# EAGLE design CPUI_Board (EAGLE 7.7.0)
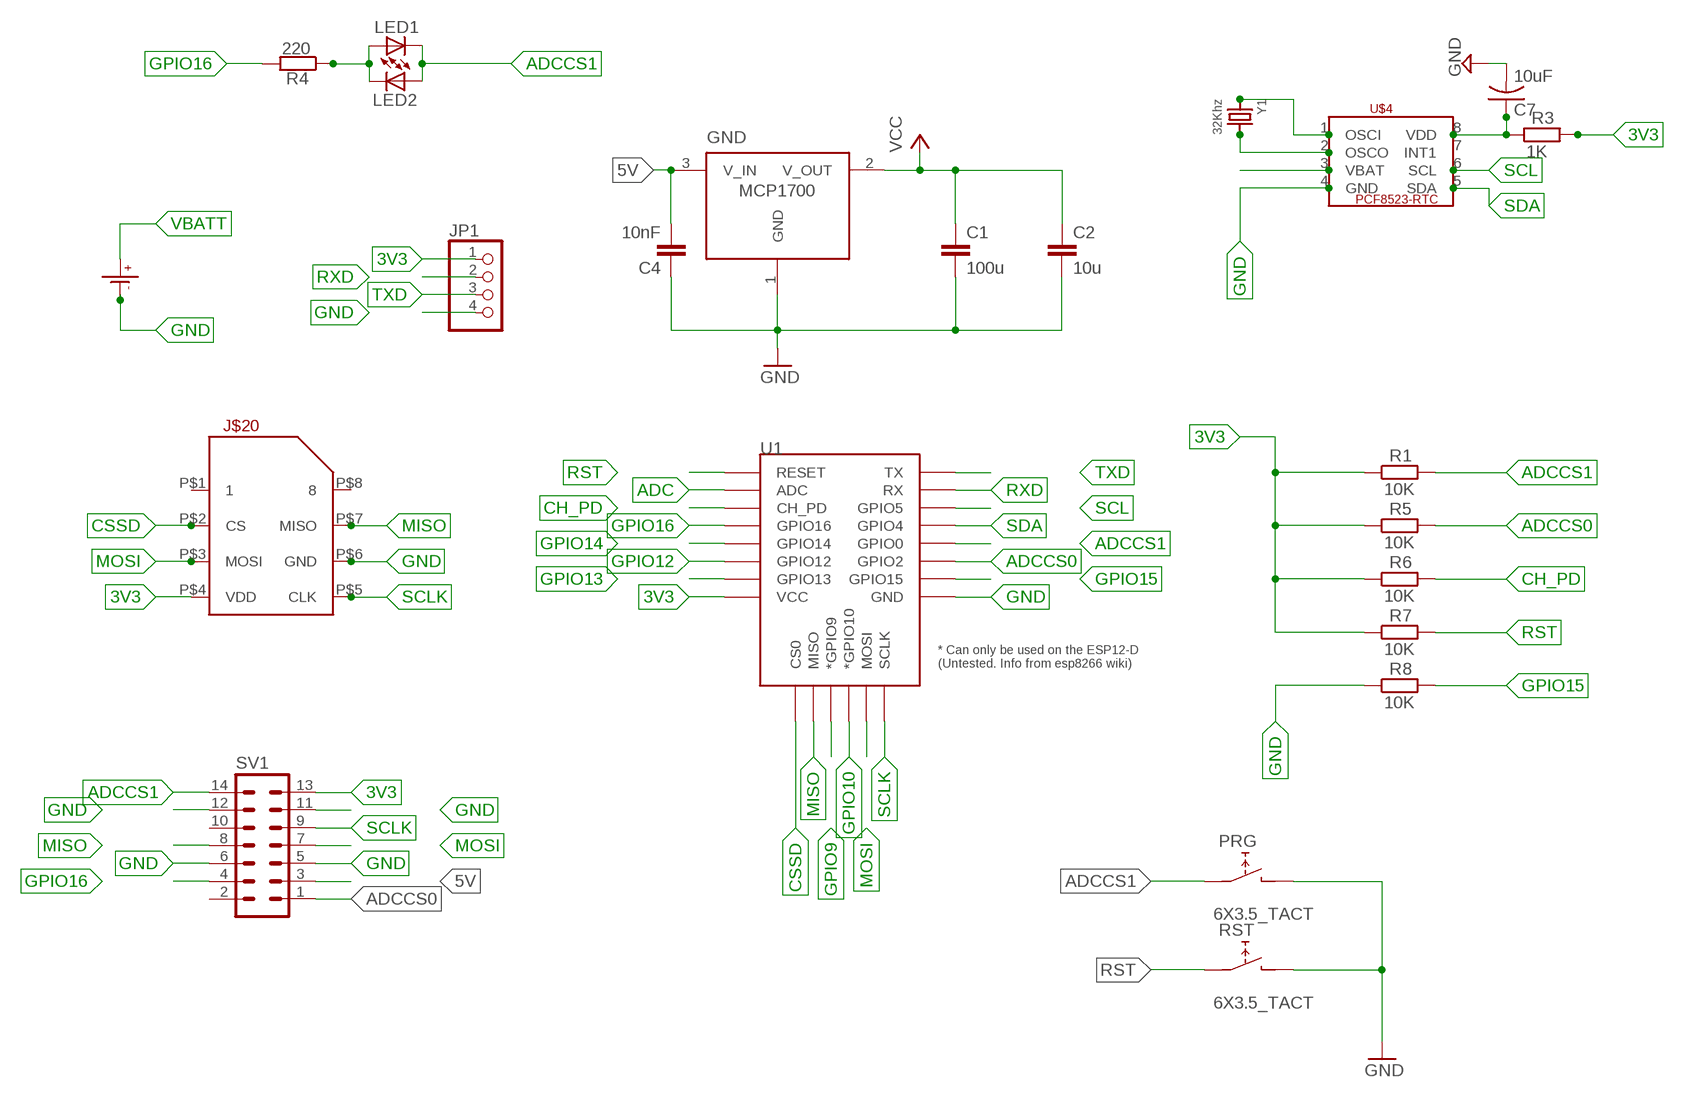
[diagram p0: schematic, sheet 1]

## Parts
C1  100u  C  [C0805]
C2  10u  C  [C0805]
C4  10nF  C  [C0805]
C7  10uF  C-USC0805  [C0805]
GND  MCP1700SOT23  [SOT-23]
J$20  MICROSD_PUSH/PULL  [MICROSD]
JP1  PINHD-1X4  [1X04]
LED1  LEDCHIPLED_0805  [CHIPLED_0805]
LED2  LEDCHIPLED_0805  [CHIPLED_0805]
PRG  6X3.5_TACT  [TACT_6X3.5]
R1  10K  R-EU_R0805  [R0805]
R3  1K  R-EU_R0805  [R0805]
R4  220  R-EU_R0805  [R0805]
R5  10K  R-EU_R0805  [R0805]
R6  10K  R-EU_R0805  [R0805]
R7  10K  R-EU_R0805  [R0805]
R8  10K  R-EU_R0805  [R0805]
RST  6X3.5_TACT  [TACT_6X3.5]
SV1  MA07-2  [MA07-2]
U1  ESP12ESMD  [ESP12E-SMD]
U$1  CR1220SMD  [CR1220SMD]
U$4  PCF8523_RTC  [SOIC_8]
Y1  32Khz  CRYSTAL8X3.8SMT  [CRYSTAL_8X3.8]

## Nets
3V3: C1.1 C2.1 GND.2(V_OUT) J$20.P$4(VDD) JP1.1 R1.1 R3.2 R5.1 R6.1 R7.1 SV1.13 U1.VCC ; supply symbol labelled VCC
5V: C4.2 GND.3(V_IN) SV1.3
ADC: U1.ADC
ADCCS0: R5.2 SV1.1 U1.GPIO2
ADCCS1: LED1.C LED2.A PRG.P$1 R1.2 SV1.14 U1.GPIO0
CH_PD: R6.2 U1.CH_PD
CSSD: J$20.P$2(CS) U1.CS0
GND: C1.2 C2.2 C4.1 C7.2 GND.1(GND) J$20.P$6(GND) JP1.4 PRG.P$2 R8.1 RST.P$2 SV1.5 SV1.6 SV1.11 SV1.12 U1.GND U$1.P-(P$-) U$4.4(GND)
GPIO9: U1.GPIO9(*GPIO9)
GPIO10: U1.GPIO10(*GPIO10)
GPIO12: U1.GPIO12
GPIO13: U1.GPIO13
GPIO14: U1.GPIO14
GPIO15: R8.2 U1.GPIO15
GPIO16: R4.2 SV1.4 U1.GPIO16
MISO: J$20.P$7(MISO) SV1.8 U1.MISO
MOSI: J$20.P$3(MOSI) SV1.7 U1.MOSI
N$1: C7.1 R3.1 U$4.8(VDD)
N$8: LED1.A LED2.C R4.1
N$44: U$4.2(OSCO) Y1.P$4
N$45: U$4.1(OSCI) Y1.P$1
RST: R7.2 RST.P$1 U1.RESET
RXD: JP1.2 U1.RXD0(RX)
SCL: U1.GPIO5 U$4.6(SCL)
SCLK: J$20.P$5(CLK) SV1.9 U1.SCLK
SDA: U1.GPIO4 U$4.5(SDA)
TXD: JP1.3 U1.TXD0(TX)
VBATT: U$1.P+(P$+) U$4.3(VBAT)
Unconnected: J$20.P$1 J$20.P$8 SV1.2 SV1.10 U$4.7(INT1)

## Library data of the parts
C1 C2 C4 = eagle-ltspice:C: CAPACITOR, European symbol; SPICEMODEL: NONE; SPICEPREFIX: C
C7 = adafruit:C-US: CAPACITOR, American symbol
GND = MCP1700:MCP1700SOT23
J$20 = IotaWatt_parts:MICROSD_PUSH/PULL: McroSD Amphenol push/pull
JP1 = pinhead:PINHD-1X4: PIN HEADER
LED1 LED2 = adafruit:LED: LED OSRAM: - CHIPLED LG R971, LG N971, LY N971, LG Q971, LY Q971, LO R971, LY R971 LH N974, LH R974 LS Q976, LO Q976, LY Q976 LO Q996 - Hyper CHIPLED LW Q18S LB Q993, LB Q99A, LB R99A - SideLED LS A670, LO A670, LY A670, LG A670, LP A670 LB A673, LV A673, LT A673, LW A673 LH A674 LY A675 LS A676, LA A676, LO A676, LY A676, LW A676 LS A679, LY A679, LG A679 - Hyper Micro SIDELED® LS Y876, LA Y876, LO Y876, LY Y876 LT Y87S - SmartLED LW L88C, LW L88S LB L89C, LB L89S, LG L890 LS L89K, LO L89K, LY L89K LS L896, LA L896, LO L896, LY L896 - TOPLED LS T670, LO T670, LY T670, LG T670, LP T670 LSG T670, LSP T670, LSY T670, LOP T670, LYG T670 LG T671, LOG T671, LSG T671 LB T673, LV T673, LT T673, LW T673 LH T674 LS T676, LA T676, LO T676, LY T676, LB T676, LH T676, LSB T676, LW T676 LB T67C, LV T67C, LT T67C, LS T67K, LO T67K, LY T67K, LW E67C LS E67B, LA E67B, LO E67B, LY E67B, LB E67C, LV E67C, LT E67C LW T67C LS T679, LY T679, LG T679 LS T770, LO T770, LY T770, LG T770, LP T770 LB T773, LV T773, LT T773, LW T773 LH T774 LS E675, LA E675, LY E675, LS T675 LS T776, LA T776, LO T776, LY T776, LB T776 LHGB T686 LT T68C, LB T68C - Hyper Mini TOPLED® LB M676 - Mini TOPLED Santana® LG M470 LS M47K, LO M47K, LY M47K Source: http://www.osram.convergy.de/
PRG RST = tactile_switch:6X3.5_TACT
R1 R3-R8 = resistor:R-EU_: RESISTOR, European symbol
SV1 = con-lstb:MA07-2: PIN HEADER; OC_FARNELL: unknown; OC_NEWARK: unknown
U1 = esp8266modules:ESP12E: ESP12E Module
U$1 = IotaWatt4.8:CR1220SMD: CR1220 Battery SMD
U$4 = IotaWatt_parts:PCF8523_RTC: PCF8523-RTC SOIC-8
Y1 = microbuilder:CRYSTAL: Crystals HC49UP - Surface Mount Crystal 4.0MHz 18pF +/-30ppm Surface Mount Crystal [Digikey: 535-9857-1-ND] 12.0 MHz Surface Mount Crystal [Digikey: 535-9869-6-ND] 25.0 MHz Surface Mount Crystal [Digikey: 535-9078-1-ND] 2.5 x 2.0mm - MEMs SMT Crystal 16.0 MHz 10pF 20ppm 2.5 x 2.0mm Crystal [Digikey -40-85°C: 535-10923-1-ND] 3.2 x 2.5mm - MEMs SMT Crystal 12.0 MHz 8pF 15ppm 3.2 x 2.5mm Crystal [Digikey: -10-70°C: 644-1047-1-ND -40-125°C: 644-1128-1-ND] 16.0 MHz 8pF 15ppm 3.2 x 2.5mm Crystal [Digikey: -10-70°C: 644-1049-1-ND -40-125°C: 644-1129-2-ND] 16.0 MHz 10pF 10ppm 3.2 x 2.5mm Crystal [Digikey: 644-1100-1-ND] 27.12 MHz 18pF 30ppm 3.2 x 2.5mm Crystal [Digikey: 887-1424-1-ND] 27.12MHz 10pF 10ppm 3.2 x 2.5mm Crystal [Digikey: 887-1329-1-ND] 4.9 x 1.8mm - MEMs SMT Crystal 32.768 KHz 12.5pF 20ppm 4.9 x 1.8mm Crystal [Digikey: SE2415CT-ND] 8.0 x 3.8mm - Surface Mount Crystal 32.768kHz 12.5pF 20ppm -40°C-85°C [Digikey: 535-9166-2-ND] Cylinder 32.768KHz Cylinder Crystal (2x6mm body) [Ex. Digikey: 300-8341-2-ND]

## Board
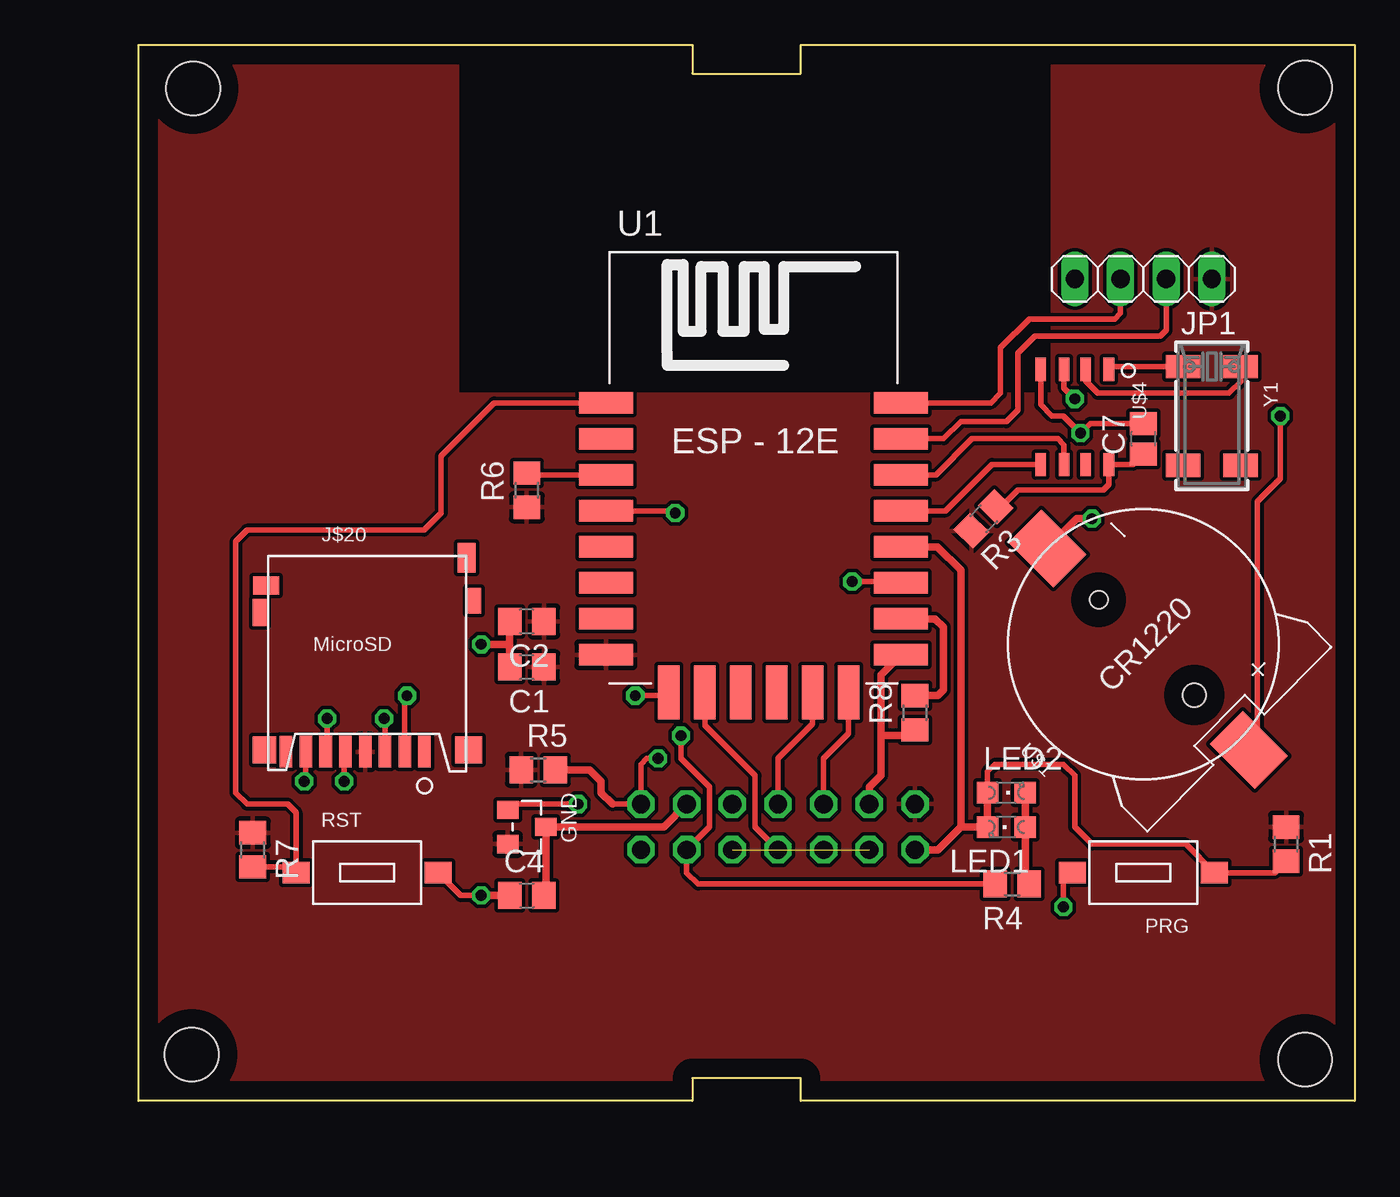
[diagram p1: board, top side]
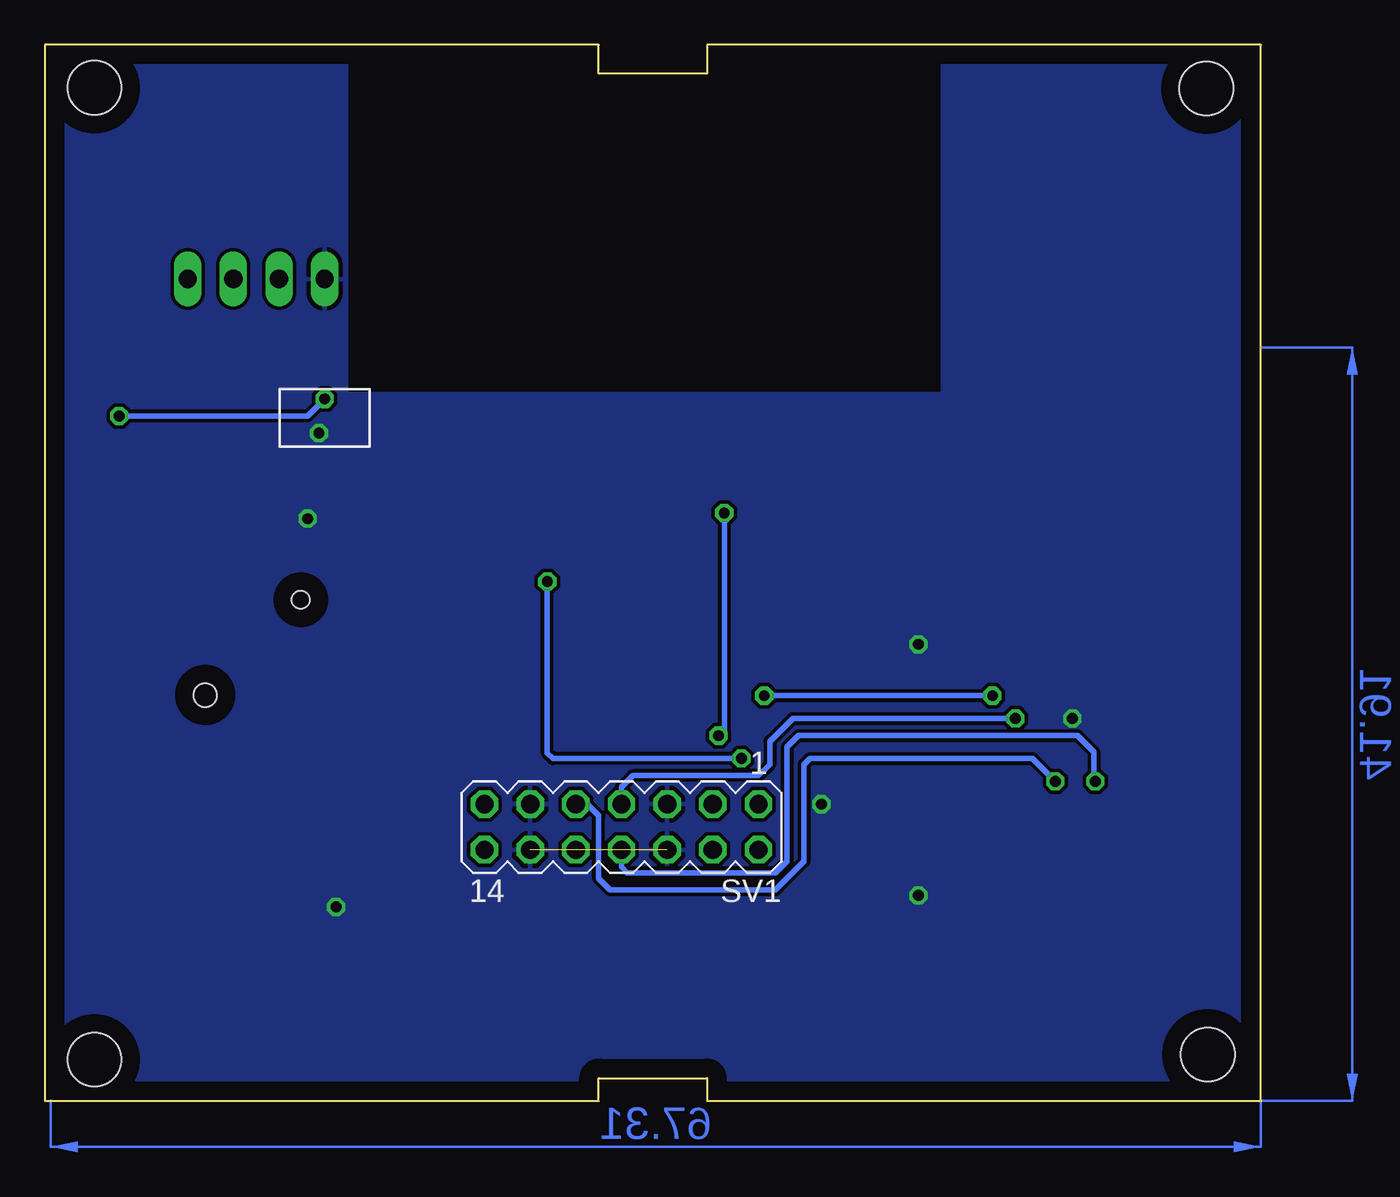
[diagram p2: board, bottom side, seen from below]

Size 67.63 x 58.74 mm. Coordinates in mm from the lower left corner, seen from the top.
Outline: 0,58.74 30.8,58.74 30.8,57.15 36.83,57.15 36.83,58.74 67.63,58.74 67.63,0 36.83,0 36.83,1.27 30.8,1.27 30.8,0 0,0 0,58.74
Copper layers (1*16): Top 0.035mm / dielectric 1.5mm / Bottom 0.035mm
Design rules "default": minimum track width 10mil, minimum drill 24mil, track to track 8mil, track to pad 8mil, pad to pad 8mil, via to via 8mil, smd to smd 8mil, copper to edge 40mil, drill to drill 8mil, minimum pad ring 10mil, minimum via ring 8mil, stop-mask expansion 4mil, vias tented up to drill 0mil, thermal gap 10mil
Holes 3 mm at 3.03,56.32 64.87,56.35 64.88,2.31 2.96,2.58

### Footprints (pad centres in the part's own frame; a part is rotated, then mirrored left to right if it is on the bottom)
C0805 = smd 1.3 x 1.5: 1 -0.95,0; 2 0.95,0
C0805' = smd 1.3 x 1.5: 1 -0.85,0; 2 0.85,0
SOT-23 = smd 1.016 x 1.2: 1 -0.95,-1.06; 2 0.95,-1.06; 3 0,1.06
MICROSD = smd 0.7 x 1.75: P$1 3.2,-0.9; P$2 2.1,-0.9; P$3 1,-0.9; P$4 -0.1,-0.9; P$5 -1.2,-0.9; P$6 -2.3,-0.9; P$7 -3.4,-0.9; P$8 -4.5,-0.9 | smd 1.3 x 1.5: P$9 -5.7,-0.8 | smd 1.5 x 1.5: P$10 5.65,-0.8 | smd 0.8 x 1.5: P$11 -5.95,6.85 | smd 0.8 x 1.4: P$13 5.95,7.5 | smd 1 x 1.65: P$CD1 5.55,9.9 | smd 1.45 x 1: P$CD2 -5.6,8.35
1X04 = drill 1.016 long: 1 -3.81,0; 2 -1.27,0; 3 1.27,0; 4 3.81,0
CHIPLED_0805 = smd 1.2 x 1.2: A 0,-1.05; C 0,1.05
TACT_6X3.5 = smd 1.5 x 1.2: P$1 -3.95,0; P$2 3.95,0
R0805 = smd 1.3 x 1.5: 1 -0.95,0; 2 0.95,0
MA07-2 = drill 1.016 octagon: 1 -7.62,-1.27; 2 -7.62,1.27; 3 -5.08,-1.27; 4 -5.08,1.27; 5 -2.54,-1.27; 6 -2.54,1.27; 7 0,-1.27; 8 0,1.27; 9 2.54,-1.27; 10 2.54,1.27; 11 5.08,-1.27; 12 5.08,1.27; 13 7.62,-1.27; 14 7.62,1.27
ESP12E-SMD = smd 3 x 1.2: ADC -8.3,3.8; CH_PD -8.3,1.8; GND 8.1,-8.2; GPIO0 8.1,-2.2; GPIO2 8.1,-4.2; GPIO4 8.1,-0.2; GPIO5 8.1,1.8; GPIO12 -8.3,-4.2; GPIO13 -8.3,-6.2; GPIO14 -8.3,-2.2; GPIO15 8.1,-6.2; GPIO16 -8.3,-0.2; RESET -8.3,5.8; RXD0 8.1,3.8; TXD0 8.1,5.8; VCC -8.3,-8.2 | smd 1.2 x 3: CS0 -4.8,-10.3; GPIO9 -0.8,-10.3; GPIO10 1.2,-10.3; MISO -2.8,-10.3; MOSI 3.2,-10.3; SCLK 5.2,-10.3
CR1220SMD = smd 3.54 x 2.6: P+ 8.3,0; P- -7.55,0 | hole 1: -3.5,0 | hole 1.3: 4,0
SOIC_8 = smd 1.3 x 0.6: 1 -2.6,1.9; 2 -2.6,0.6; 3 -2.6,-0.6; 4 -2.6,-1.9; 5 2.7,-1.9; 6 2.7,-0.6; 7 2.7,0.6; 8 2.7,1.9
CRYSTAL_8X3.8 = smd 1.3 x 1.9: P$1 -2.75,-1.6; P$2 2.75,-1.6; P$3 2.75,1.6; P$4 -2.75,1.6

### Placement (x,y rotation side)
C1  21.59,24.13 180 top
C2  21.59,26.67 180 top
C4  21.59,11.43 0 top
C7  10uF  [C0805']  55.88,36.83 90 top
GND  21.59,15.24 270 top
J$20  12.7,20.32 0 top
JP1  55.88,45.72 180 top
LED1  48.26,15.24 90 top
LED2  48.26,17.14 270 top
PRG  55.88,12.7 180 top
R1  63.82,14.29 270 top
R3  46.99,32.38 225 top
R4  48.58,12.06 180 top
R5  22.23,18.41 0 top
R6  21.59,33.97 90 top
R7  6.35,13.97 270 top
R8  43.18,21.59 90 top
RST  12.7,12.7 0 top
SV1  35.56,15.24 180 bottom
U1  34.29,33.02 0 top
U$1  55.88,25.4 315 top
U$4  52.07,38.1 270 top
Y1  59.69,38.1 270 top

### Tracks (layer width: path | path; a pad name or v marks a point on that pad's centre or on a via)
3V3
  pour Top: 0,58.42 17.78,58.42 17.78,39.37 50.8,39.37 50.8,58.42 67.31,58.42 67.31,0 0,0
5V
  Top 0.406: SV1.3 29.21,15.24 GND.3 22.65,11.54 C4.2
ADCCS0  (via drill 0.6)
  Top 0.305: U1.GPIO2 42.32,28.89 v39.69,28.89 | v28.89,19.05 28.26,19.05 27.94,18.73 SV1.1 26.35,16.51
  Top 0.406: R5.2 25.08,18.41 25.72,17.78 25.72,17.14 26.35,16.51
  Bottom 0.305: v28.89,19.05 39.37,19.05 39.69,19.37 v39.69,28.89
ADCCS1
  Top 0.305: 45.72,20 45.72,20.32 | R1.2 63.18,12.7 PRG.P$1 58.24,14.29 53.02,14.29 52.07,15.24 52.07,18.1 51.44,18.73 47.62,18.73 47.21,18.32 LED2.A
  Top 0.406: SV1.14 44.45,13.97 45.72,15.24 | U1.GPIO0 44.43,30.82 45.72,29.53 45.72,20.32 45.72,15.24 | LED2.A LED1.C 45.72,15.24
CH_PD
  Top 0.305: R6.2 21.69,34.82 U1.CH_PD
CSSD  (via drill 0.6)
  Top 0.305: U1.CS0 29.31,22.54 v27.62,22.54 | J$20.P$2 14.8,22.42 v14.92,22.54
  Bottom 0.305: v27.62,22.54 v14.92,22.54
GND  (via drill 0.6)  (1 unrouted)
  Top 0.305: J$20.P$6 10.48,19.34 v10.48,21.27 | RST.P$2 17.92,11.43 v19.05,11.43 | PRG.P$2 51.44,12.7 v51.44,10.79 | U$4.4 50.17,38.73 50.8,38.1 51.44,38.1 v52.39,37.15 52.92,37.68 C7.2 | v24.45,16.51 20.85,16.51 GND.1
  Top 0.406: U1.GND 41.27,23.7 41.27,20.32 | 41.27,20.32 41.27,18.1 40.64,17.46 SV1.11 | R8.1 42.86,20.32 41.27,20.32 | C4.1 v19.05,11.43 | C1.2 20.64,25.4 | 20.64,25.4 C2.2 | v19.05,25.4 20.64,25.4 | U$1.P- 52.19,32.38 v53.02,32.38
  pour Bottom: 0,58.42 17.78,58.42 17.78,39.37 50.8,39.37 50.8,58.42 67.31,58.42 67.31,0 0,0
GPIO15
  Top 0.406: U1.GPIO15 44.3,26.82 44.77,26.35 44.77,22.86 44.45,22.54 R8.2
GPIO16  (via drill 0.6)
  Top 0.305: R4.2 31.11,12.06 30.48,12.7 SV1.4 31.75,15.24 31.75,17.46 30.16,19.05 v30.16,20.32 | v29.84,32.7 29.73,32.82 U1.GPIO16
  Bottom 0.305: v30.16,20.32 29.84,20.64 v29.84,32.7
MISO  (via drill 0.6)
  Top 0.305: SV1.8 34.29,15.24 34.29,18.1 31.49,20.9 U1.MISO | 9.21,19.33 J$20.P$7 9.3,17.87 v9.21,17.78
  Bottom 0.305: SV1.8 35.56,13.02 35.24,12.7 26.99,12.7 26.35,13.34 26.35,19.68 25.72,20.32 10.2,20.32 J$20.P$7 9.3,17.87 v9.21,17.78
MOSI  (via drill 0.6)
  Top 0.305: U1.MOSI 37.49,20.98 35.56,19.05 SV1.7 | 13.65,19.37 J$20.P$3 13.7,21.23 v13.65,21.27
  Bottom 0.305: SV1.7 35.56,17.46 34.92,18.1 27.94,18.1 27.3,18.73 27.3,20 26.04,21.27 v13.65,21.27
N$1
  Top 0.305: C7.1 55.3,35.4 U$4.8 53.97,34.28 53.66,33.97 48.9,33.97 47.98,33.06 R3.1
N$8
  Top 0.406: LED2.C LED1.A 49.31,12.48 R4.1
N$44
  Top 0.305: U$4.2 52.67,40.04 53.34,39.37 60.64,39.37 61.29,40.02 Y1.P$4
N$45
  Top 0.305: U$4.1 54.12,40.85 Y1.P$1
RST
  Top 0.305: U1.RESET 19.77,38.82 16.83,35.88 16.83,32.7 15.88,31.75 6.03,31.75 5.4,31.11 5.4,17.14 6.03,16.51 8.29,16.51 8.75,16.05 RST.P$1 8.43,13.02 R7.2
RXD
  Top 0.305: U1.RXD0 44.77,36.83 45.72,37.78 48.26,37.78 48.9,38.42 48.9,41.59 49.85,42.55 56.83,42.55 57.15,42.86 JP1.2
SCL
  Top 0.305: U1.GPIO5 44.34,34.82 46.35,36.83 51.12,36.83 51.47,36.48 U$4.6
SCLK  (via drill 0.6)
  Top 0.305: U1.SCLK 39.49,20.44 38.1,19.05 SV1.9 | J$20.P$5 11.43,19.35 v11.43,17.78
  Bottom 0.305: SV1.9 37.47,16.51 36.83,15.88 36.83,12.38 36.2,11.75 26.99,11.75 25.4,13.34 25.4,18.73 25.08,19.05 12.7,19.05 v11.43,17.78
SDA
  Top 0.305: U1.GPIO4 44.88,32.82 47.47,35.4 U$4.5
TXD
  Top 0.305: U1.TXD0 47.39,38.82 47.94,39.37 47.94,41.91 49.53,43.5 54.29,43.5 54.61,43.81 JP1.3
VBATT  (via drill 0.6)
  Top 0.305: U$4.3 51.47,39.65 v52.07,39.05 | v63.5,38.1 63.5,34.61 62.23,33.34 62.23,20.65 U$1.P+
  Bottom 0.305: v52.07,39.05 53.02,38.1 v63.5,38.1
(copper drawn outside any net)
  shapes: Bottom area x2